# EAGLE schematic tester_V1.1 (EAGLE 9.3.0)
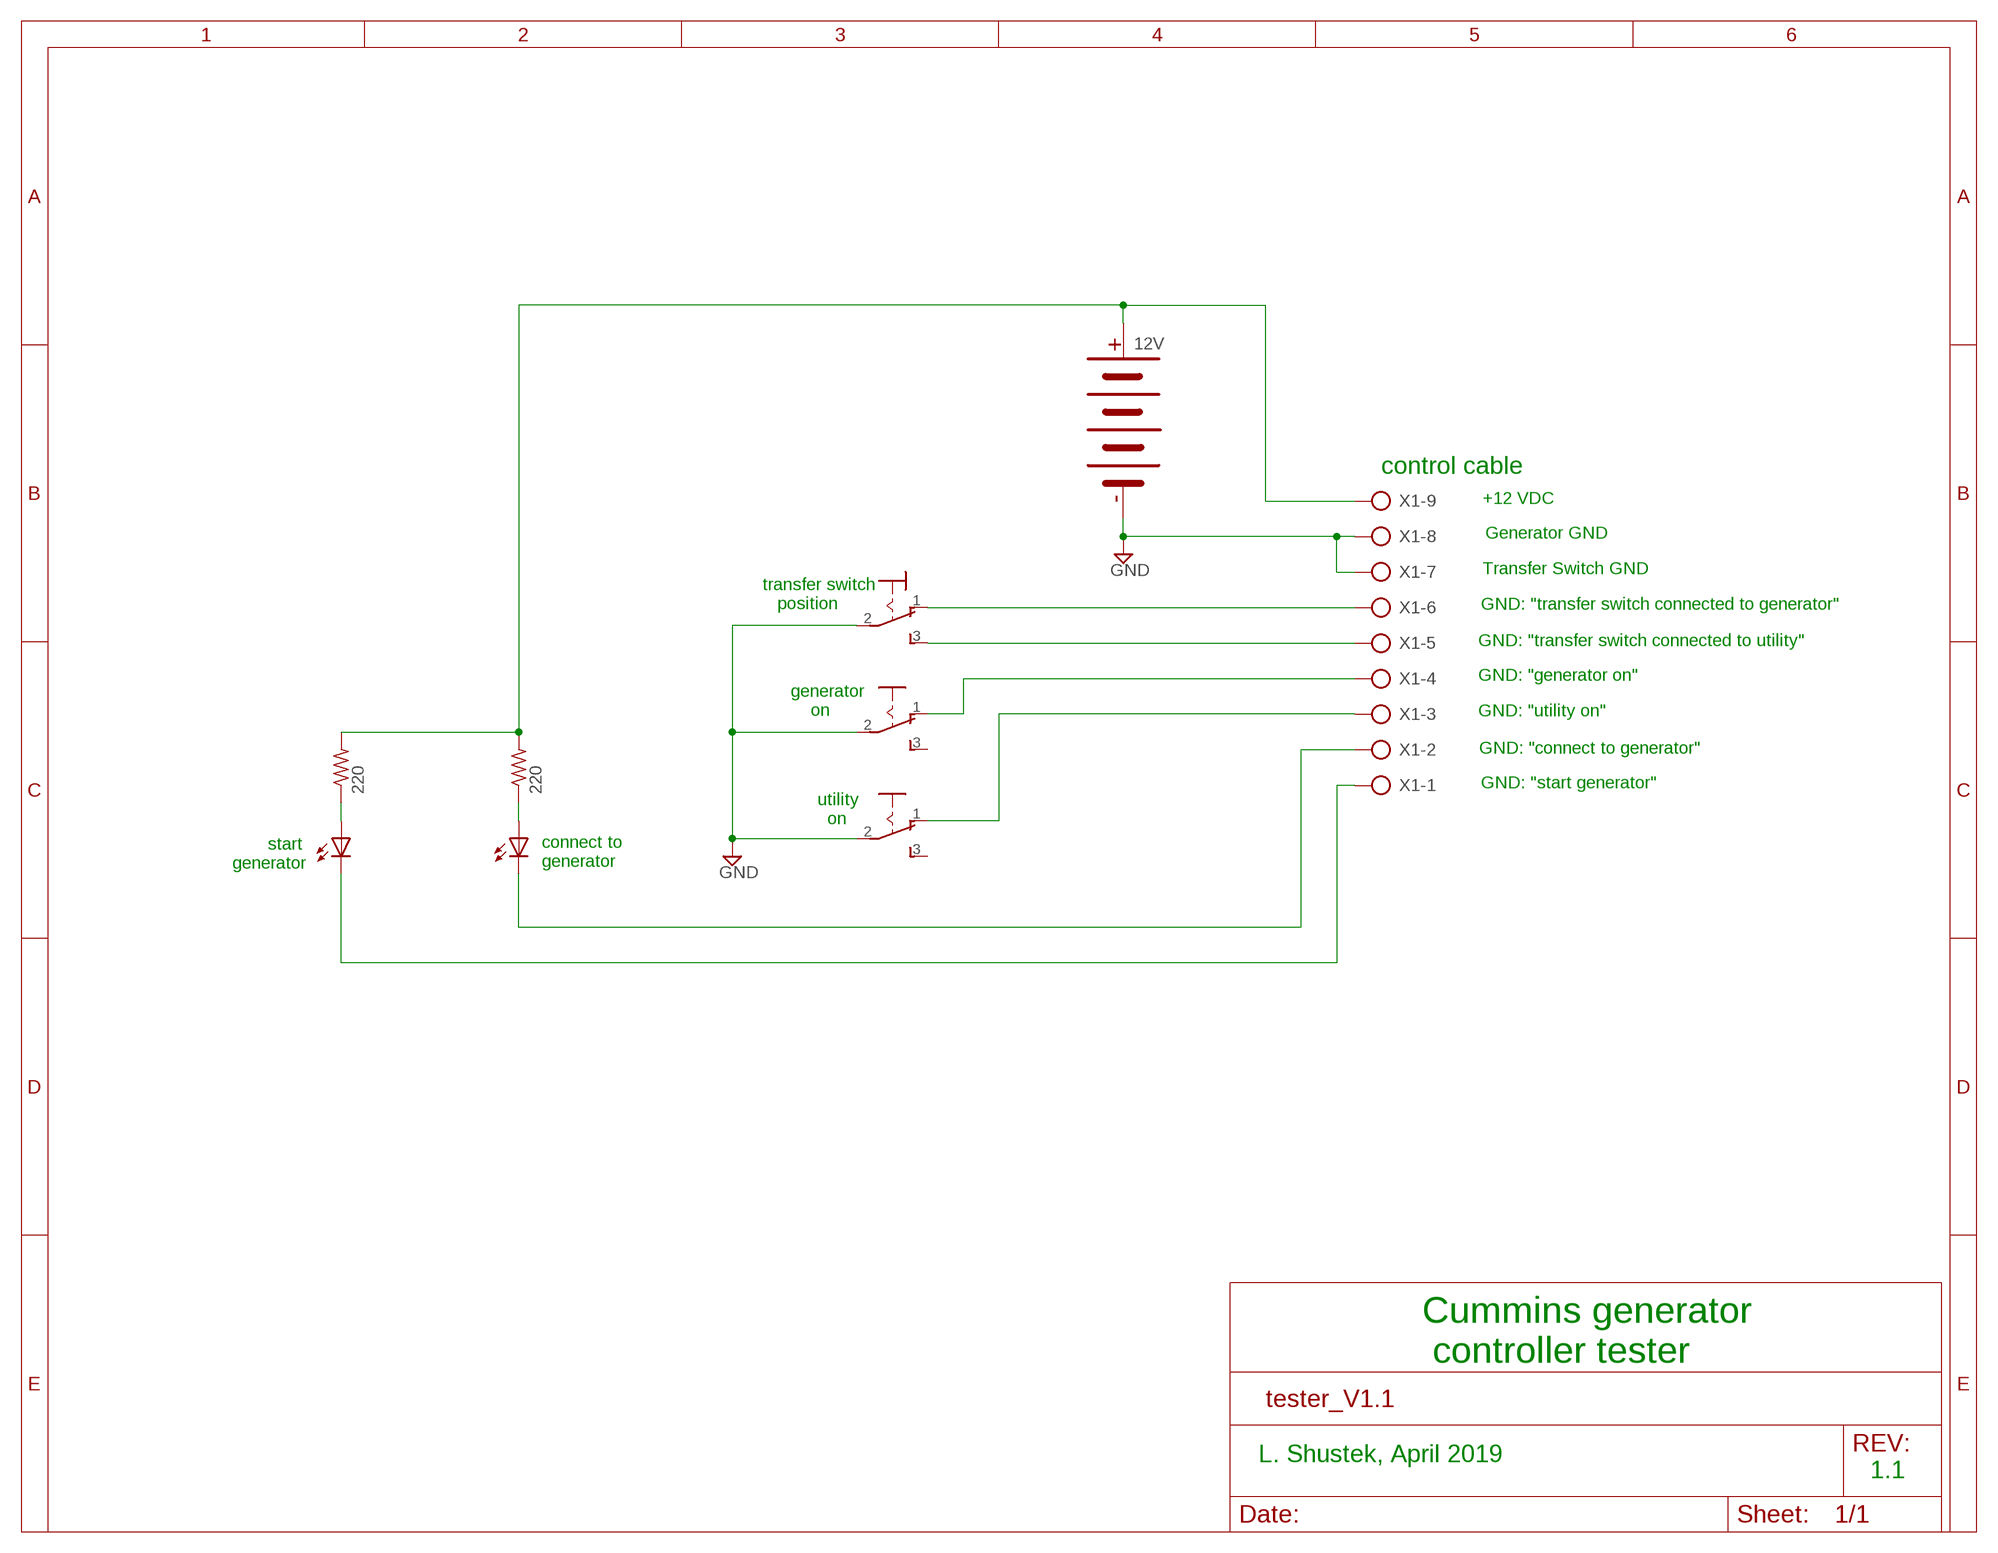
[diagram p0: schematic, sheet 1]

## Parts
LED1  LED  [SMARTLED-TTW]
LED2  LED  [SMARTLED-TTW]
R1  220  R-US_0204/5  [0204/5]
R2  220  R-US_0204/5  [0204/5]
S1  320-916  [320-916]
S2  255SB  [255SB]
S3  255SB  [255SB]
U$1  12V  4-CELL-BATTERY  [4-CELL-BATTERY]
X1  AK500/9  [AK500/9]

## Nets
GND: S1.2(P) S2.2(P) S3.2(P) U$1.P$1 X1.7 X1.8
N$1: S1.1(O) X1.6
N$2: R1.2 R2.2 U$1.P$2 X1.9
N$3: S1.3(S) X1.5
N$4: S3.1(O) X1.3
N$5: S2.1(O) X1.4
N$6: LED1.C@1(C) X1.1
N$7: LED1.A@1(A) R1.1
N$8: LED2.A@1(A) R2.1
N$10: LED2.C@1(C) X1.2
Unconnected: S2.3(S) S3.3(S)

## Notes on the sheet
- control cable
- +12 VDC
- Generator GND
- Transfer Switch GND
- transfer switch
     position
- GND: "transfer switch connected to generator"
- GND: "transfer switch connected to utility"
- GND: "generator on"
- generator
      on
- GND: "utility on"
- GND: "connect to generator"
- GND: "start generator"
- utility
    on
- connect to
  generator
- start
  generator
- Cummins generator
   controller tester
- L. Shustek, April 2019
- 1.1

## Library data of the parts
LED1 LED2 = adafruit:LED: LED OSRAM: - CHIPLED LG R971, LG N971, LY N971, LG Q971, LY Q971, LO R971, LY R971 LH N974, LH R974 LS Q976, LO Q976, LY Q976 LO Q996 - Hyper CHIPLED LW Q18S LB Q993, LB Q99A, LB R99A - SideLED LS A670, LO A670, LY A670, LG A670, LP A670 LB A673, LV A673, LT A673, LW A673 LH A674 LY A675 LS A676, LA A676, LO A676, LY A676, LW A676 LS A679, LY A679, LG A679 - Hyper Micro SIDELED® LS Y876, LA Y876, LO Y876, LY Y876 LT Y87S - SmartLED LW L88C, LW L88S LB L89C, LB L89S, LG L890 LS L89K, LO L89K, LY L89K LS L896, LA L896, LO L896, LY L896 - TOPLED LS T670, LO T670, LY T670, LG T670, LP T670 LSG T670, LSP T670, LSY T670, LOP T670, LYG T670 LG T671, LOG T671, LSG T671 LB T673, LV T673, LT T673, LW T673 LH T674 LS T676, LA T676, LO T676, LY T676, LB T676, LH T676, LSB T676, LW T676 LB T67C, LV T67C, LT T67C, LS T67K, LO T67K, LY T67K, LW E67C LS E67B, LA E67B, LO E67B, LY E67B, LB E67C, LV E67C, LT E67C LW T67C LS T679, LY T679, LG T679 LS T770, LO T770, LY T770, LG T770, LP T770 LB T773, LV T773, LT T773, LW T773 LH T774 LS E675, LA E675, LY E675, LS T675 LS T776, LA T776, LO T776, LY T776, LB T776 LHGB T686 LT T68C, LB T68C - Hyper Mini TOPLED® LB M676 - Mini TOPLED Santana® LG M470 LS M47K, LO M47K, LY M47K Source: http://www.osram.convergy.de/
R1 R2 = adafruit:R-US_: RESISTOR, American symbol
S1 = switch:320-916: TOGGLE SWITCH distributor RS Components
S2 S3 = switch:255SB: SLIDING SWITCH Distributor Buerklin, 11G810
U$1 = Len:4-CELL-BATTERY
X1 = con-ptr500:AK500/9: CONNECTOR; OC_FARNELL: unknown; OC_NEWARK: unknown